# Altium schematic sheet SSRoof.SchDoc: YNAO Focuser
size A4; DrawnBy: ShouSheng He; Revision: v1.0
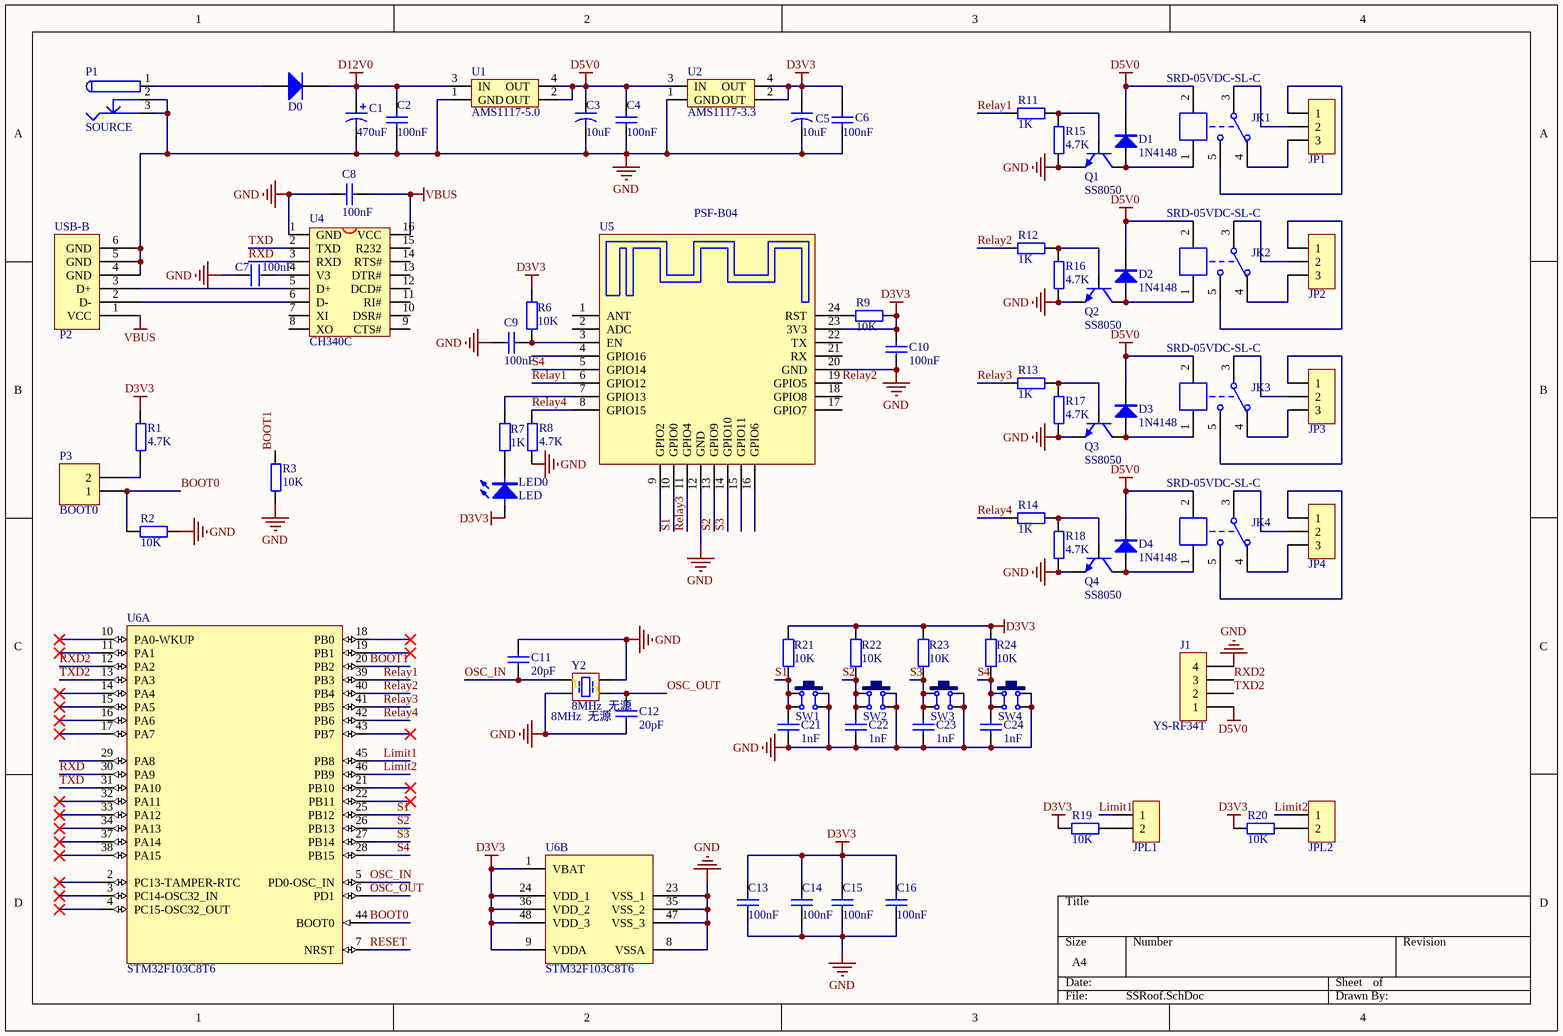
[diagram p0: SSRoof.SchDoc]

## Parts
C1  470uF  [16V/470U(CD10X10D5)]
C2  100nF  [0603C]
C3  10uF  [3216]
C4  100nF  [0603C]
C5  10uF  [3216]
C6  100nF  [0603C]
C7  100nF  [0603C]
C8  100nF  [0603C]
C9  100nF  [0603C]
C10  100nF  [0603C]
C11  20pF  [0603C]
C12  20pF  [0603C]
C13  100nF  [0603C]
C14  100nF  [0603C]
C15  100nF  [0603C]
C16  100nF  [0603C]
C21  1nF  [0603C]
C22  1nF  [0603C]
C23  1nF  [0603C]
C24  1nF  [0603C]
D0  M7  [DO-214AC]  (value not drawn)
D1  1N4148  [SOD-323]
D2  1N4148  [SOD-323]
D3  1N4148  [SOD-323]
D4  1N4148  [SOD-323]
J1  YS-RF34T  [XH-4-SIDE]
JK1  SRD-05VDC-SL-C  [SRD-C_B]
JK2  SRD-05VDC-SL-C  [SRD-C_B]
JK3  SRD-05VDC-SL-C  [SRD-C_B]
JK4  SRD-05VDC-SL-C  [SRD-C_B]
JP1  HDR-1X3  [KF2EDGK5.0-LI-3P]  (value not drawn)
JP2  HDR-1X3  [KF2EDGK5.0-LI-3P]  (value not drawn)
JP3  HDR-1X3  [KF2EDGK5.0-LI-3P]  (value not drawn)
JP4  HDR-1X3  [KF2EDGK5.0-LI-3P]  (value not drawn)
JPL1  HDR-1X2  [KF2EDGK5.0-LI-2P]  (value not drawn)
JPL2  HDR-1X2  [KF2EDGK5.0-LI-2P]  (value not drawn)
LED0  LED  [LED-0603]
P1  SOURCE  [DC_5.5MM]
P2  USB-B  [USB-B]
P3  BOOT0  [HDR1X2]
Q1  SS8050  [SOT23-3N]
Q2  SS8050  [SOT23-3N]
Q3  SS8050  [SOT23-3N]
Q4  SS8050  [SOT23-3N]
R1  4.7K  [0603R]
R2  10K  [0603R]
R3  10K  [0603R]
R6  10K  [0603R]
R7  1K  [0603R]
R8  4.7K  [0603R]
R9  10K  [0603R]
R11  1K  [0603R]
R12  1K  [0603R]
R13  1K  [0603R]
R14  1K  [0603R]
R15  4.7K  [0603R]
R16  4.7K  [0603R]
R17  4.7K  [0603R]
R18  4.7K  [0603R]
R19  10K  [0603R]
R20  10K  [0603R]
R21  10K  [0603R]
R22  10K  [0603R]
R23  10K  [0603R]
R24  10K  [0603R]
SW1  6x6x5  [TSW SMD-12*12*8]  (value not drawn)
SW2  6x6x5  [TSW SMD-12*12*8]  (value not drawn)
SW3  6x6x5  [TSW SMD-12*12*8]  (value not drawn)
SW4  6x6x5  [TSW SMD-12*12*8]  (value not drawn)
U1  AMS1117-5.0  [SOT223]
U2  AMS1117-3.3  [SOT223]
U4  CH340C  [SO-16]
U5  PSF-B04
U6  STM32F103C8T6  [LQFP48_N]  (parts A,B of 2)
Y2  8MHz  无源  [X3225]

## Nets
D3V3: C5.1 C6.2 C10.1 C13.2 C14.2 C15.2 C16.2 LED0.1(A) R1.2 R6.2 R9.2 R19.1 R20.1 R21.2 R22.2 R23.2 R24.2 U2.2(OUT) U2.4(OUT) U5.23(3V3) U6.1(VBAT) U6.9(VDDA) U6.24(VDD_1) U6.36(VDD_2) U6.48(VDD_3)
D5V0: C3.1 C4.2 D1.2(K) D2.2(K) D3.2(K) D4.2(K) J1.1 JK1.2 JK2.2 JK3.2 JK4.2 U1.2(OUT) U1.4(OUT) U2.3(IN)
D12V0: C1.1 C2.2 D0.2(K) U1.3(IN)
GND: C1.2 C2.1 C3.2 C4.1 C5.2 C6.1 C7.1 C8.1 C9.2 C10.2 C11.2 C12.2 C13.1 C14.1 C15.1 C16.1 C21.2 C22.2 C23.2 C24.2 J1.4 P1.2 P1.3 P2.4(GND) P2.5(GND) P2.6(GND) Q1.2(E) Q2.2(E) Q3.2(E) Q4.2(E) R2.2 R3.1 R8.1 R15.1 R16.1 R17.1 R18.1 SW1.2 SW1.3 SW2.2 SW2.3 SW3.2 SW3.3 SW4.2 SW4.3 U1.1(GND) U2.1(GND) U4.1(GND) U5.12(GND) U5.20(GND) U6.8(VSSA) U6.23(VSS_1) U6.35(VSS_2) U6.47(VSS_3) Y2.2(NA) Y2.4(NA)
VBUS: C8.2 P2.1(VCC) U4.16(VCC)
BOOT0: P3.1 R2.1 U6.44(BOOT0)
BOOT1: R3.2 U6.20(PB2)
Limit1: JPL1.1 U6.45(PB8)
Limit2: JPL2.1 U6.46(PB9)
OSC_IN: C11.1 U6.5(PD0-OSC_IN) Y2.1(OSC1)
OSC_OUT: C12.1 U6.6(PD1) Y2.3(OSC2)
Relay1: R11.2 U5.6(GPIO12) U6.39(PB3)
Relay2: R12.2 U5.19(GPIO5) U6.40(PB4)
Relay3: R13.2 U5.11(GPIO4) U6.41(PB5)
Relay4: R8.2 R14.2 U5.8(GPIO15) U6.42(PB6)
RESET: U6.7(NRST)
RXD: U4.3(RXD) U6.30(PA9)
RXD2: J1.3 U6.12(PA2)
S1: C21.1 R21.1 SW1.1 SW1.4 U5.10(GPIO0) U6.25(PB12)
S2: C22.1 R22.1 SW2.1 SW2.4 U5.13(GPIO9) U6.26(PB13)
S3: C23.1 R23.1 SW3.1 SW3.4 U5.14(GPIO10) U6.27(PB14)
S4: C24.1 R24.1 SW4.1 SW4.4 U5.5(GPIO14) U6.28(PB15)
TXD: U4.2(TXD) U6.31(PA10)
TXD2: J1.2 U6.13(PA3)
NetC7_2: C7.2 U4.4(V3)
NetC9_1: C9.1 R6.1 U5.3(EN)
NetD0_1: D0.1(A) P1.1
NetD1_1: D1.1(A) JK1.1 Q1.3(C)
NetD2_1: D2.1(A) JK2.1 Q2.3(C)
NetD3_1: D3.1(A) JK3.1 Q3.3(C)
NetD4_1: D4.1(A) JK4.1 Q4.3(C)
NetJK1_3: JK1.3 JP1.2
NetJK1_4: JK1.4 JP1.3
NetJK1_5: JK1.5 JP1.1
NetJK2_3: JK2.3 JP2.2
NetJK2_4: JK2.4 JP2.3
NetJK2_5: JK2.5 JP2.1
NetJK3_3: JK3.3 JP3.2
NetJK3_4: JK3.4 JP3.3
NetJK3_5: JK3.5 JP3.1
NetJK4_3: JK4.3 JP4.2
NetJK4_4: JK4.4 JP4.3
NetJK4_5: JK4.5 JP4.1
NetJPL1_2: JPL1.2 R19.2
NetJPL2_2: JPL2.2 R20.2
NetLED0_2: LED0.2(C) R7.2
NetP2_2: P2.2(D-) U4.6(D-)
NetP2_3: P2.3(D+) U4.5(D+)
NetP3_2: P3.2 R1.1
NetQ1_1: Q1.1(B) R11.1 R15.2
NetQ2_1: Q2.1(B) R12.1 R16.2
NetQ3_1: Q3.1(B) R13.1 R17.2
NetQ4_1: Q4.1(B) R14.1 R18.2
NetR7_1: R7.1 U5.7(GPIO13)
NetR9_1: R9.1 U5.24(RST)

Not connected (* = marked no-connect by the designer): U4 7(XI) 8(XO) 9(CTS#) 10(DSR#) 11(RI#) 12(DCD#) 13(DTR#) 14(RTS#) 15(R232); U5 1(ANT) 2(ADC) 4(GPIO16) 9(GPIO2) 15(GPIO11) 16(GPIO6) 17(GPIO7) 18(GPIO8) 21(RX) 22(TX); U6 2(PC13-TAMPER-RTC)* 3(PC14-OSC32_IN)* 4(PC15-OSC32_OUT)* 10(PA0-WKUP)* 11(PA1)* 14(PA4)* 15(PA5)* 16(PA6)* 17(PA7)* 18(PB0)* 19(PB1)* 21(PB10)* 22(PB11)* 29(PA8) 32(PA11)* 33(PA12)* 34(PA13)* 37(PA14)* 38(PA15)* 43(PB7)*

## Library data of the parts
C1 = C470UF016S: 470UF      16V      CD10X10D5
C2 C4 C6 C8-C16 C21-C24 = Cap: Capacitor; Published: 8-Jun-2000; LatestRevisionDate: 17-Jul-2002; LatestRevisionNote: Re-released for DXP Platform.; PackageReference: RAD-0.3; Publisher: Altium Limited
  C2 C4 C6 C8-C10 C13-C16: Value: 100nF
  C11 C12: Value: 20pF
  C21-C24: Value: 1nF
C3 C5 = CAP2: vaule: 10uF
C7 = C
D0 = Diode: High Conductance Fast Diode; pin to pad: 1>2 2>1; Published: 8-Jun-2000; LatestRevisionDate: 17-Jul-2002; LatestRevisionNote: Re-released for DXP Platform.; DatasheetDocument: 1997; PackageReference: DO-35; Publisher: Altium Limited; Code_JEDEC: DO-204-AH; ComponentLink1Description: Manufacturer Link; ComponentLink1URL: http://www.fairchildsemi.com/; ComponentLink2Description: Datasheet; ComponentLink2URL: http://www.fairchildsemi.com/ds/1N%2F1N4448.pdf
D1-D4 = 1N4148: 高速开关二极管; 版权归属: 源创客; BOM名称: 高速开关二极管; 学习资源: www.ooocke.com
J1 = HDR1x4: Connector
JK1-JK4 = SRD-05VDC-SL-C: 5V一组转换; BOM名称: 5V继电器; 版权归属: 源创客; 学习资源: www.ooocke.com
JP1-JP4 = Header 3: 3P接插件; 版权归属: 源创客; BOM名称: 3P接插件; 学习资源: www.ooocke.com
JPL1 JPL2 = Header 2: 2P接插件; 版权归属: 源创客; BOM名称: 2P接插件; 学习资源: www.ooocke.com
P3 = MHDR1X2: Header, 2-Pin; LatestRevisionDate: 17-Jul-2002; LatestRevisionNote: Re-released for DXP Platform.; Publisher: Altium Limited
Q1-Q4 = 8050-SMD: 高频放大-NPN型; 版权归属: 源创客; 属性: 40V 1.5A 1W 100MHZ; BOM名称: 高频放大-NPN型; 学习资源: www.ooocke.com
R1 R3 R8 R15-R18 = R
R2 R6 R9 R19-R24 = RES: Resistor; Value: 1K; Published: 8-Jun-2000; Revision: July-2002: Re-released for DXP Platform.; Publisher: Altium Limited
R7 R11-R14 = RES: Resistor; Published: 8-Jun-2000; Revision: July-2002: Re-released for DXP Platform.; Publisher: Altium Limited; Value: 1K
SW1-SW4 = TSW SMD-6x6: 贴片6x6轻触开关; 版权归属: 源创客; BOM名称: 贴片6x6轻触开关; 学习资源: www.ooocke.com
U1 U2 = AMS1117
U4 = CH340G: USB2UART
U6 = STM32F103C8T6: STM32 ARM-based 32-bit MCU Performance Line with 64 kB Flash, 20 kB Internal RAM, -40 to +85癈 Temperature, 48-Pin LQFP, Tray; DatasheetVersion: rev13.0, Apr-2011; PackageVersion: rev13, Apr-2011; PackageReference: LQFP48; PackageDescription: 48-Pin Low-Profile Quad Flat Pack, 7 x 7 mm Body, 0.5 mm Pitch (LQFP48); ComponentLink1Description: Manufacturer URL; ComponentLink1URL: http://www.st.com/; ComponentLink2Description: STM32F103 Datasheet; ComponentLink2URL: http://www.st.com/internet/com/TECHNICAL_RESOURCES/TECHNICAL_LITERATURE/DATASHEET/CD00161566.pdf; ComponentLink3Description: STM32 Family Web Page; ComponentLink3URL: www.st.com/stm32
Y2 = XTAL_1: Crystal Oscillator; Published: 8-Jun-2000; LatestRevisionDate: 17-Jul-2002; LatestRevisionNote: Re-released for DXP Platform.; PackageReference: R38; Publisher: Altium Limited; Value: 8MHz  无源
P1 = SOURCE: LatestRevisionDate: 17-Jul-2002; LatestRevisionNote: Re-released for DXP Platform.; Publisher: Altium Limited